# EAGLE design buses (EAGLE 8.3.2)
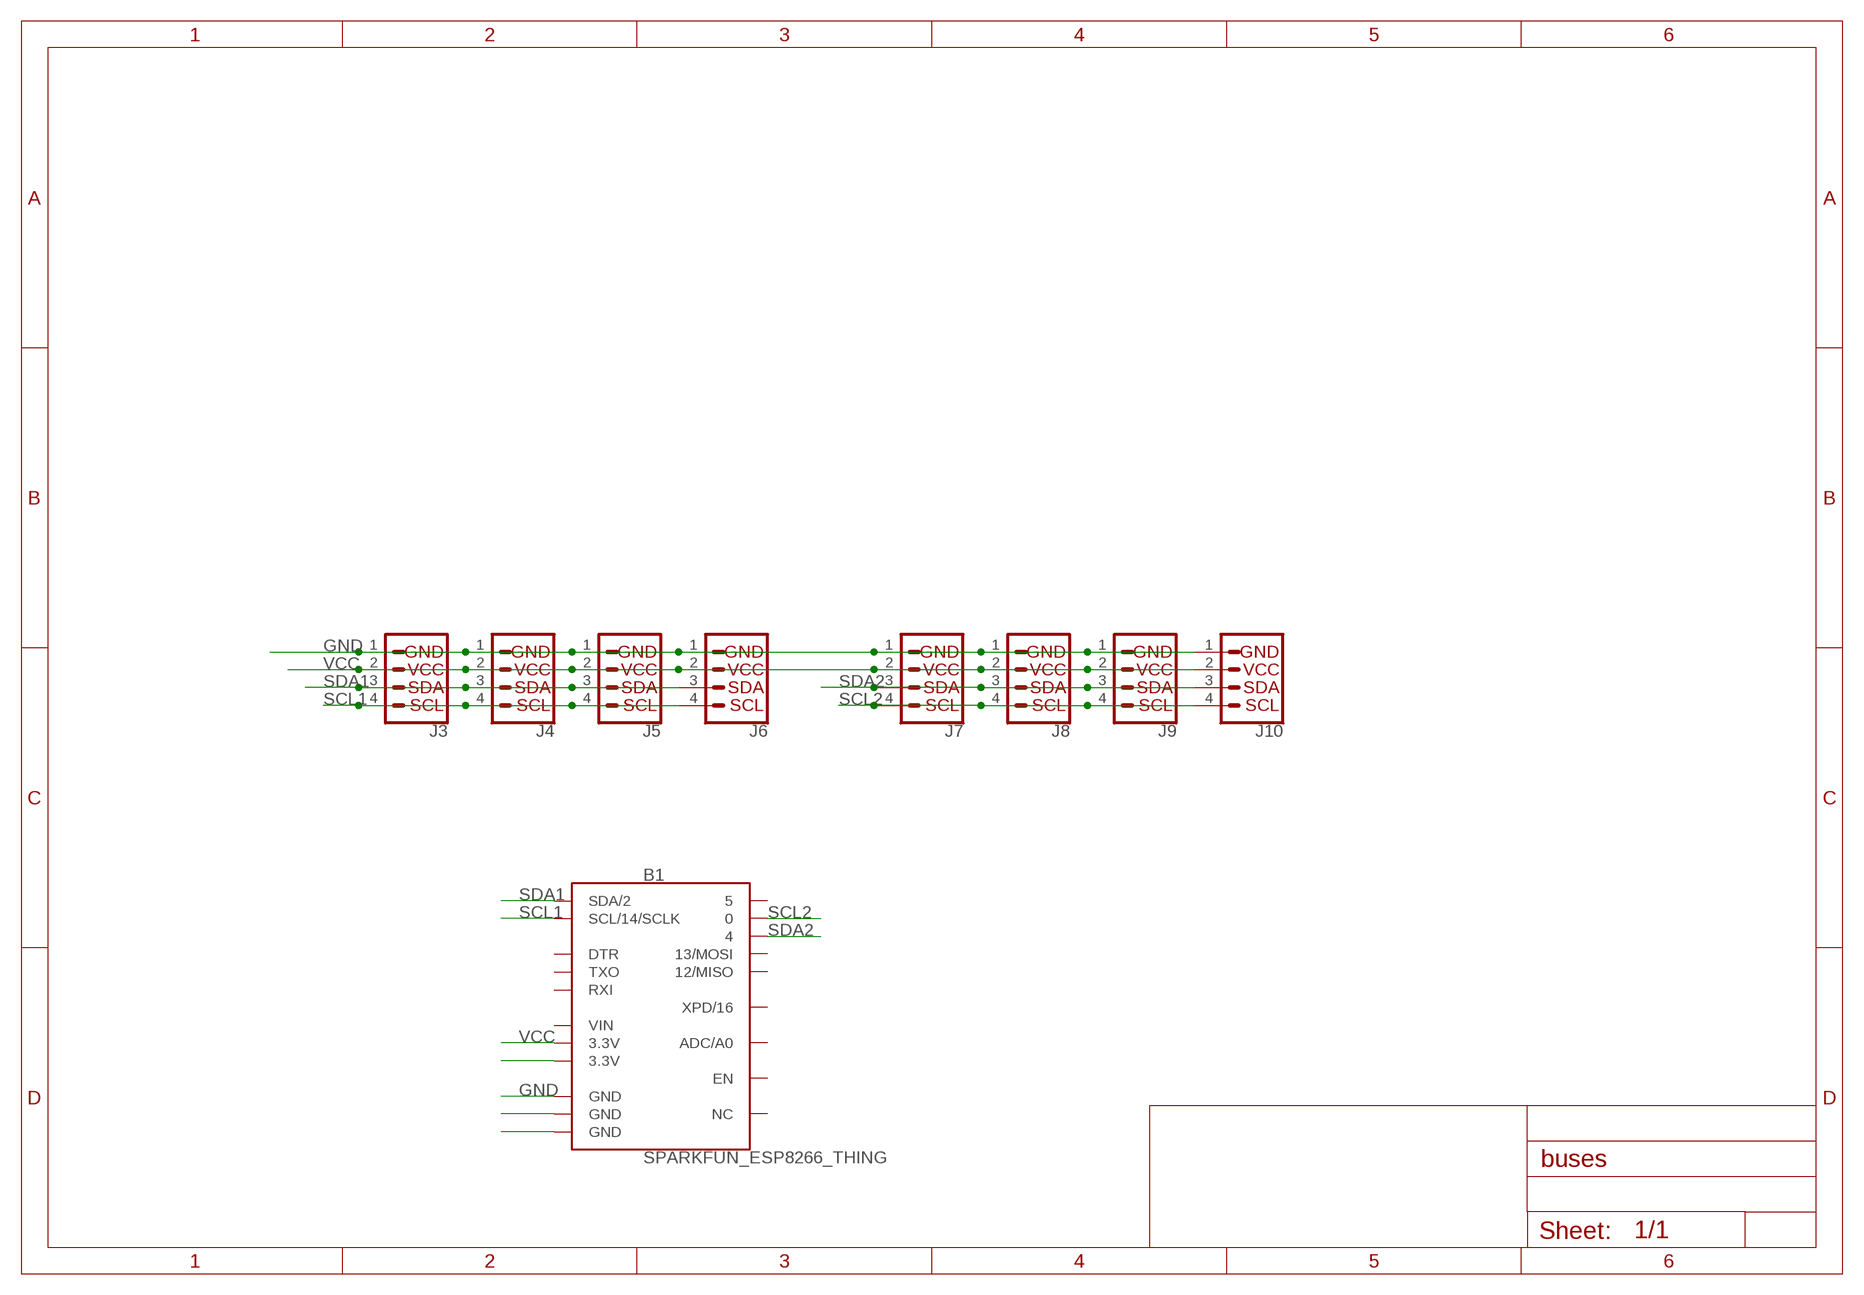
[diagram p0: schematic, sheet 1]

## Parts
B1  SPARKFUN_ESP8266_THING  [SPARKFUN_ESP8266_THING]
J3  I2C_STANDARD  [1X04]
J4  I2C_STANDARD  [1X04]
J5  I2C_STANDARD  [1X04]
J6  I2C_STANDARD  [1X04]
J7  I2C_STANDARD  [1X04]
J8  I2C_STANDARD  [1X04]
J9  I2C_STANDARD  [1X04]
J10  I2C_STANDARD  [1X04]

## Nets
GND: B1.GND@1(GND) B1.GND@2(GND) B1.GND@3(GND) J3.1 J4.1 J5.1 J6.1 J7.1 J8.1 J9.1 J10.1
SCL1: B1.SCL(SCL/14/SCLK) J3.4 J4.4 J5.4 J6.4
SCL2: B1.0 J7.4 J8.4 J9.4 J10.4
SDA1: B1.SDA(SDA/2) J3.3 J4.3 J5.3 J6.3
SDA2: B1.4 J7.3 J8.3 J9.3 J10.3
VCC: B1.3.3V@1(3.3V) B1.3.3V@2(3.3V) J3.2 J4.2 J5.2 J6.2 J7.2 J8.2 J9.2 J10.2
Unconnected: B1.5 B1.12(12/MISO) B1.13(13/MOSI) B1.ADC(ADC/A0) B1.DTR B1.EN B1.NC B1.RXI B1.TXO B1.XPD(XPD/16)

## Power pins joined to a net without a drawn wire
VIN: B1.VIN

## Library data of the parts
B1 = SparkFun-Boards:SPARKFUN_ESP8266_THING: SparkFun Thing Board The SparkFun ESP8266 Thing is a breakout and development board for the ESP8266 WiFi SoC SparkFun Products: SparkFun ESP8266 Thing <https://www.sparkfun.com/products/13231>; SF_ID: WRL-13231
J3-J10 = SparkFun-Connectors:I2C_STANDARD: SparkFun I2C Standard Pinout Header SparkFun has standardized on a pinout for all I2C based sensor breakouts. This pinout allows I2C boards to be plugged directly into the headers on Arduino Uno compatible boards, and to be daisy chained easily. Example SparkFun Products: SparkFun Atmospheric Sensor Breakout - BME280 <https://www.sparkfun.com/products/13676> SparkFun Altitude/Pressure Sensor Breakout - MPL3115A2 <https://www.sparkfun.com/products/11084> SparkFun TOF Range Finder Sensor - VL6180 <https://www.sparkfun.com/products/12785>

## Net classes
0 default: clearance 0.205 mm

## Board
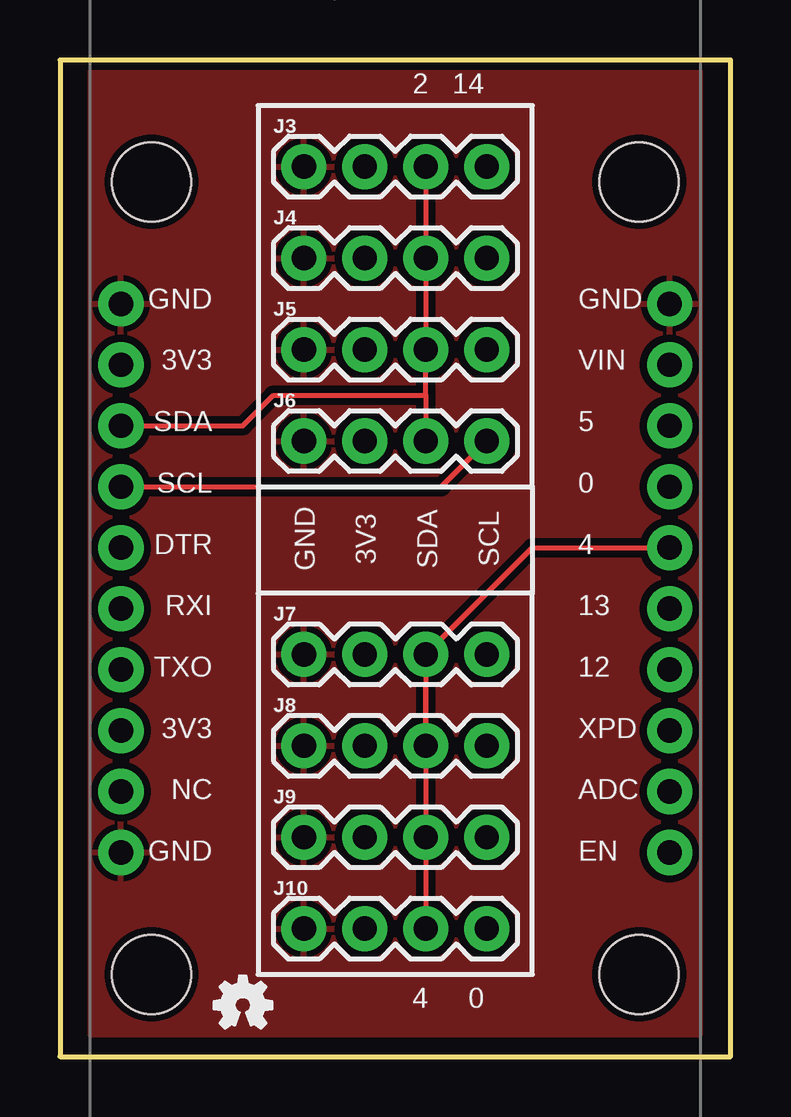
[diagram p1: board, top side]
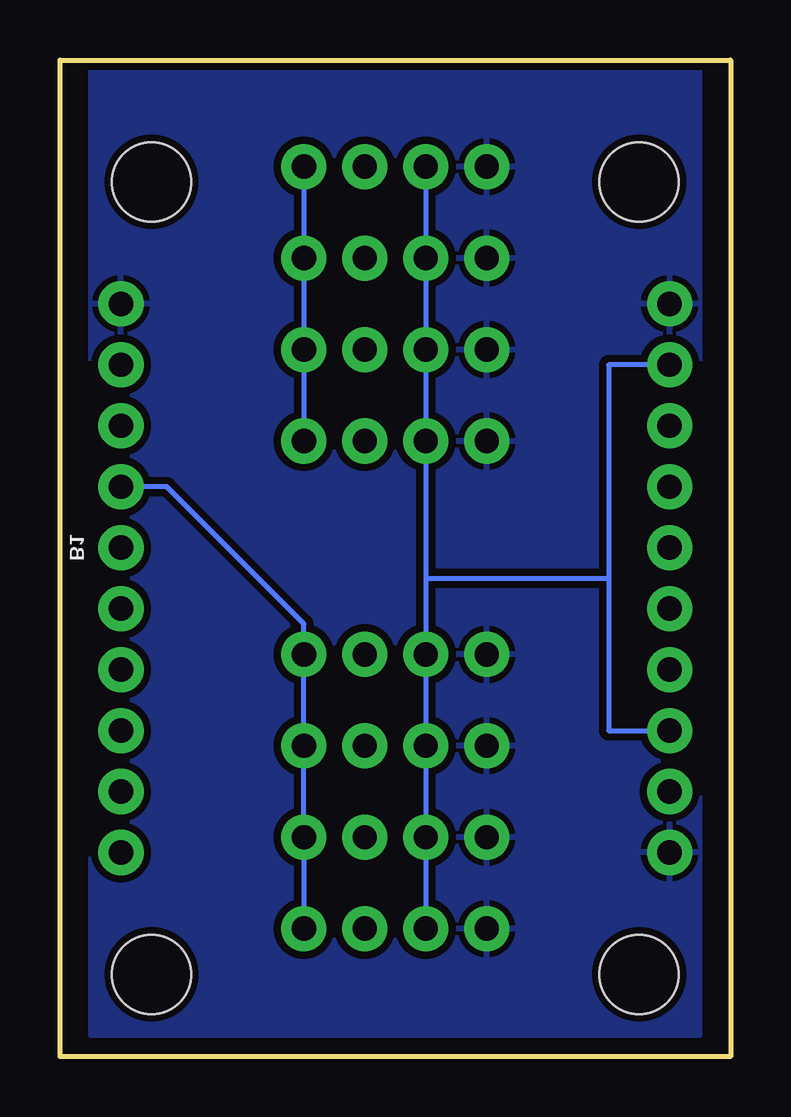
[diagram p2: board, bottom side, seen from below]

Size 27.94 x 41.53 mm. Coordinates in mm from the lower left corner, seen from the top.
Outline: 0,0 27.94,0 27.94,41.53 0,41.53 0,0
Copper layers (1*16): Top 0.035mm / dielectric 1.5mm / Bottom 0.035mm
Design rules "SparkFun": minimum track width 8mil, minimum drill 20mil, track to track 8mil, track to pad 8mil, pad to pad 8mil, via to via 8mil, smd to smd 8mil, copper to edge 8mil, drill to drill 8mil, minimum pad ring 12mil, minimum via ring 10mil, stop-mask expansion 4mil, vias tented up to drill 20mil, thermal gap 10mil

### Footprints (pad centres in the part's own frame; a part is rotated, then mirrored left to right if it is on the bottom)
SPARKFUN_ESP8266_THING = drill 1.016 pad 1.88: 0 -2.54,11.43; 3.3V@1 -7.62,-11.43; 3.3V@2 7.62,-11.43; 4 0,11.43; 5 -5.08,11.43; 12 5.08,11.43; 13 2.54,11.43; ADC 10.16,11.43; DTR 0,-11.43; EN 12.7,11.43; GND@1 -10.16,-11.43; GND@2 12.7,-11.43; GND@3 -10.16,11.43; NC 10.16,-11.43; RXI 5.08,-11.43; SCL -2.54,-11.43; SDA -5.08,-11.43; TXO 2.54,-11.43; VIN -7.62,11.43; XPD 7.62,11.43 | hole 3.302: -15.24,-10.16; -15.24,10.16; 17.78,10.16; 17.78,-10.16
1X04 = drill 1.016 pad 1.88: 1 0,0; 2 2.54,0; 3 5.08,0; 4 7.62,0

### Placement (x,y rotation side)
B1  13.97,21.21 270 top
J3  10.16,37.08 0 top
J4  10.16,33.27 0 top
J5  10.16,29.46 0 top
J6  10.16,25.65 0 top
J7  10.16,16.76 0 top
J8  10.16,12.95 0 top
J9  10.16,9.14 0 top
J10  10.16,5.33 0 top
U$1  [OSHW-LOGO-MINI]  7.62,2.16 0 top

### Tracks (layer width: path | path; a pad name or v marks a point on that pad's centre or on a via)
GND
  pour Bottom (isolate 0.305): 1.27,41.53 26.67,41.53 26.67,0.89 1.27,0.89
  pour Top (isolate 0.305): 1.27,41.53 26.67,41.53 26.67,0.89 1.27,0.89
SCL1
  Top 0.203: B1.SCL 15.88,23.75 J6.4
  Bottom 0.203: J3.4 J4.4 J5.4 J6.4
SCL2
  Bottom 0.203: J10.4 J9.4 J8.4 J7.4 17.78,18.03 23.49,23.75 B1.0
SDA1
  Top 0.203: J3.3 J4.3 J5.3 15.24,27.56 | 15.24,27.56 J6.3 | B1.SDA 7.62,26.29 8.89,27.56 15.24,27.56
SDA2
  Top 0.203: J8.3 J9.3 J10.3 | B1.4 19.69,21.21 J7.3 J8.3 | J8.3 15.24,15.54
VCC
  Bottom 0.203: J3.2 J4.2 J5.2 J6.2 12.7,19.94 | 12.7,19.94 J7.2 J8.2 J9.2 J10.2 | B1.3.3V@1 5.08,28.83 5.08,19.94 | B1.3.3V@2 5.08,13.59 5.08,19.94 | 12.7,19.94 5.08,19.94

### Text on the board
tPlace: 2 14 | GND / 3V3 / SDA / SCL / DTR / RXI / TXO / 3V3 / NC / GND | GND / VIN / 5 / 0 / 4 / 13 / 12 / XPD / ADC / EN | GND / 3V3 / SDA / SCL | 4 0